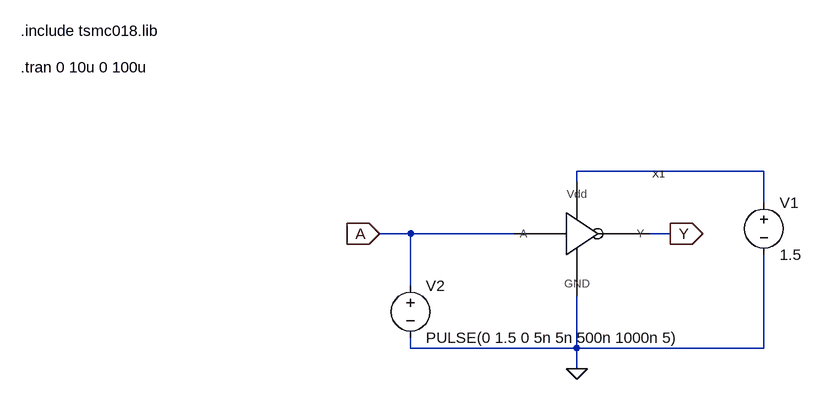
[diagram p0: schematic inverter_cmos_tb.asc]
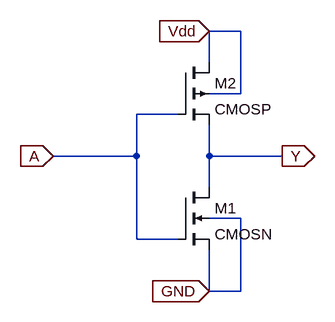
[diagram p1: sub-circuit inverter_cmos.asc]
inverter_cmos_tb.asc, the LTspice schematic file:
Version 4
SHEET 1 880 680
WIRE 512 96 224 96
WIRE 224 112 224 96
WIRE 512 144 512 96
WIRE -32 192 -80 192
WIRE 128 192 -32 192
WIRE 368 192 336 192
WIRE -32 272 -32 192
WIRE -32 368 -32 352
WIRE 224 368 224 288
WIRE 224 368 -32 368
WIRE 512 368 512 224
WIRE 512 368 224 368
WIRE 224 400 224 368
FLAG 368 192 Y
IOPIN 368 192 Out
FLAG -80 192 A
IOPIN -80 192 In
FLAG 224 400 0
SYMBOL inverter_cmos 208 192 R0
SYMATTR InstName X1
SYMBOL voltage 512 128 R0
WINDOW 123 0 0 Left 0
WINDOW 39 0 0 Left 0
SYMATTR InstName V1
SYMATTR Value 1.5
SYMBOL voltage -32 256 R0
WINDOW 123 0 0 Left 0
WINDOW 39 0 0 Left 0
SYMATTR InstName V2
SYMATTR Value PULSE(0 1.5 0 5n 5n 500n 1000n 5)
TEXT -632 -120 Left 2 !.include tsmc018.lib
TEXT -632 -64 Left 2 !.tran 0 10u 0 100u

inverter_cmos.asc, the sub-circuit schematic file:
Version 4
SHEET 1 880 680
WIRE 304 -16 256 -16
WIRE 256 32 256 -16
WIRE 304 80 304 -16
WIRE 304 80 256 80
WIRE 208 112 144 112
WIRE 144 176 144 112
WIRE 144 176 16 176
WIRE 256 176 256 128
WIRE 368 176 256 176
WIRE 256 224 256 176
WIRE 304 272 256 272
WIRE 144 304 144 176
WIRE 208 304 144 304
WIRE 256 384 256 320
WIRE 304 384 304 272
WIRE 304 384 256 384
FLAG 368 176 Y
IOPIN 368 176 Out
FLAG 16 176 A
IOPIN 16 176 In
FLAG 256 -16 Vdd
IOPIN 256 -16 In
FLAG 256 384 GND
IOPIN 256 384 In
SYMBOL cmosn 208 224 R0
SYMATTR InstName M1
SYMATTR Value2 l=180n w=1u
SYMBOL cmosp 208 32 R0
SYMATTR InstName M2
SYMATTR Value2 l=180n w=1u

The netlist it stands for:
* inverter_cmos_tb.asc
XX1 N001 0 Y A inverter_cmos
V1 N001 0 1.5
V2 A 0 PULSE(0 1.5 0 5n 5n 500n 1000n 5)

* block symbol definitions
.subckt inverter_cmos Vdd GND Y A
M1 Y A GND GND CMOSN l=180n w=1u
M2 Vdd A Y Vdd CMOSP l=180n w=1u
.ends inverter_cmos

.model NMOS NMOS
.model PMOS PMOS
.lib standard.mos
.include tsmc018.lib
.tran 0 10u 0 100u
.backanno
.end